# Altium schematic sheet EsquematicoAmplificador.SchDoc
size A4
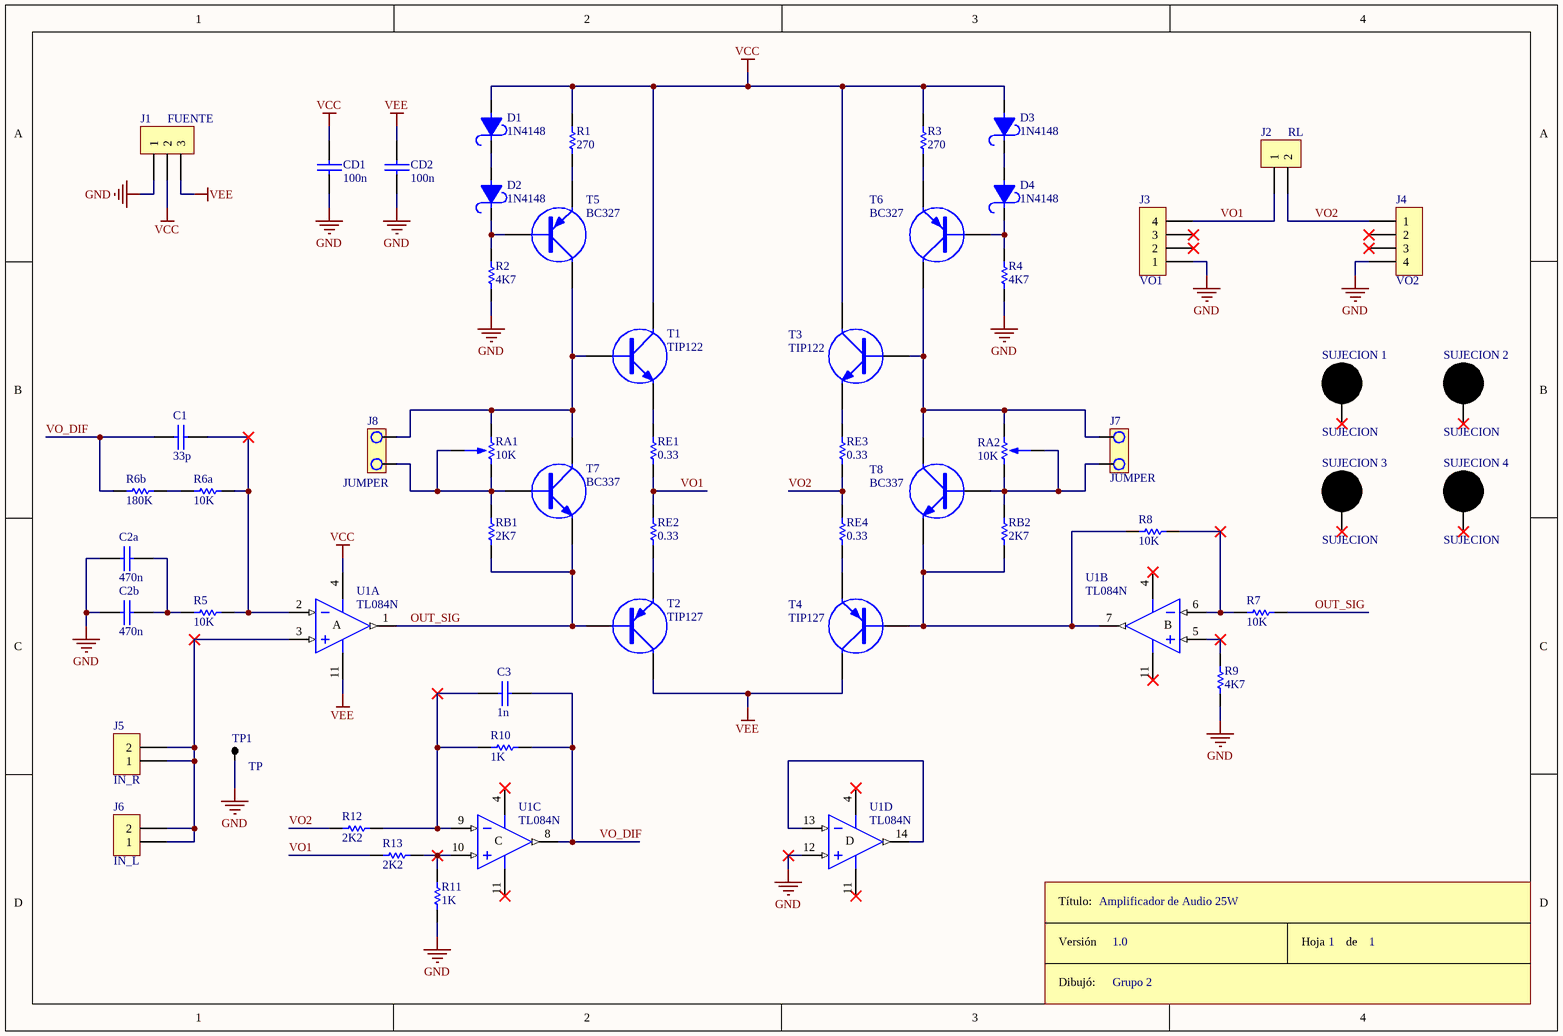
[diagram p0: EsquematicoAmplificador.SchDoc]

## Parts
C1  33p  [CAP100]
C2a  470n  [CAP200]
C2b  470n  [CAP200]
C3  1n  [CAP100]
CD1  100n  [CAP100]
CD2  100n  [CAP100]
D1  1N4148  [DO41]
D2  1N4148  [DO41]
D3  1N4148  [DO41]
D4  1N4148  [DO41]
J1  FUENTE  [CONECTOR PASO 0.156" 3 PINES]
J2  RL  [CONECTOR PASO 0.156" 2 PINES]
J3  VO1  [SIP4]
J4  VO2  [SIP4]
J5  IN_R  [SIP2]
J6  IN_L  [SIP2]
J7  JUMPER  [JUMPER2]
J8  JUMPER  [JUMPER2]
R1  270  [RES300]
R2  4K7  [RES300]
R3  270  [RES300]
R4  4K7  [RES300]
R5  10K  [RES300]
R6a  10K  [RES300]
R6b  180K  [RES300]
R7  10K  [RES300]
R8  10K  [RES300]
R9  4K7  [RES300]
R10  1K  [RES300]
R11  1K  [RES300]
R12  2K2  [RES300]
R13  2K2  [RES300]
RA1  10K  [PRESET V]
RA2  10K  [PRESET V]
RB1  2K7  [RES300]
RB2  2K7  [RES300]
RE1  0.33  [RES1200]
RE2  0.33  [RES1200]
RE3  0.33  [RES1200]
RE4  0.33  [RES1200]
ROT  Rótulo  (value not drawn)
SUJECION_1  SUJECION  [SUJECION (5.00MM - 3.50MM)]
SUJECION_2  SUJECION  [SUJECION (5.00MM - 3.50MM)]
SUJECION_3  SUJECION  [SUJECION (5.00MM - 3.50MM)]
SUJECION_4  SUJECION  [SUJECION (5.00MM - 3.50MM)]
T1  TIP122  [TO-220 V]
T2  TIP127  [TO-220 V]
T3  TIP122  [TO-220 V]
T4  TIP127  [TO-220 V]
T5  BC327  [TO92]
T6  BC327  [TO92]
T7  BC337  [TO92]
T8  BC337  [TO92]
TP1  TP  [TPTH]
U1  TL084N  [N014]  (parts A,B,C,D of 4)

## Nets
GND: C2a.1 C2b.1 CD1.2 CD2.2 J1.1 J3.1 J4.4 R2.1 R4.1 R9.1 R11.1 TP1.1 U1.12(IN+)
VCC: CD1.1 D1.1 D3.1 J1.2 R1.2 R3.2 T1.2(C) T3.2(C) U1.4(V+)
VEE: CD2.1 J1.3 T2.2(C) T4.2(C) U1.11(V-)
OUT_SIG: R7.2 RB1.1 T2.1(B) T7.3(E) U1.1(OUT)
VO1: J2.1 J3.4 R13.1 RE1.1 RE2.2
VO2: J2.2 J4.1 R12.1 RE3.1 RE4.2
VO_DIF: C1.1 C3.2 R6b.1 R10.2 U1.8(OUT)
NetC1_2: C1.2 R5.2 R6a.2 U1.2(IN-)
NetC2a_2: C2a.2 C2b.2 R5.1
NetC3_1: C3.1 R10.1 R12.2 U1.9(IN-)
NetD1_2: D1.2 D2.1
NetD2_2: D2.2 R2.2 T5.1(B)
NetD3_2: D3.2 D4.1
NetD4_2: D4.2 R4.2 T6.1(B)
NetJ5_1: J5.1 J5.2 J6.1 J6.2 U1.3(IN+)
NetJ7_1: J7.1 RA2.2 RA2.3 RB2.2 T8.1(B)
NetJ7_2: J7.2 RA2.1 T3.1(B) T6.2(C) T8.2(C)
NetJ8_1: J8.1 RA1.3 T1.1(B) T5.2(C) T7.2(C)
NetJ8_2: J8.2 RA1.1 RA1.2 RB1.2 T7.1(B)
NetR1_1: R1.1 T5.3(E)
NetR3_1: R3.1 T6.3(E)
NetR6a_1: R6a.1 R6b.2
NetR7_1: R7.1 R8.2 U1.6(IN-)
NetR8_1: R8.1 RB2.1 T4.1(B) T8.3(E) U1.7(OUT)
NetR9_2: R9.2 U1.5(IN+)
NetR11_2: R11.2 R13.2 U1.10(IN+)
NetRE1_2: RE1.2 T1.3(E)
NetRE2_1: RE2.1 T2.3(E)
NetRE3_2: RE3.2 T3.3(E)
NetRE4_1: RE4.1 T4.3(E)
NetU1_13: U1.13(IN-) U1.14(OUT)

Not connected (* = marked no-connect by the designer): J3 2* 3*; J4 2* 3*; SUJECION_1 1*; SUJECION_2 1*; SUJECION_3 1*; SUJECION_4 1*

## Notes on the sheet
- Amplificador de Audio 25W
- 1.0
- Grupo 2
- 1
- (in symbol Rótulo) Título:; Versión; Hoja       de; Dibujó:
- (in symbol TL084N, part A) A
- (in symbol TL084N, part B) B
- (in symbol TL084N, part C) C
- (in symbol TL084N, part D) D

## Library data of the parts
C1 C2a C2b C3 CD1 CD2 = CAP
D1-D4 = DIODO SCHOTTKY
J1 = CON3
J2 J5 J6 = CON2
J3 J4 = CON4
R1-R5 R6a R6b R7-R13 RB1 RB2 RE1-RE4 = RES
RA1 RA2 = PRESET
T1 T3 T7 T8 = TRANSISTOR NPN
T2 T4-T6 = TRANSISTOR PNP
U1 = TL084N: JFET-Input Operational Amplifier; Published: 16-Jan-2001; LatestRevisionDate: 04-Mar-2005; LatestRevisionNote: Stylized 3D Model Added.; DatasheetVersion: Feb-1999; PackageVersion: Oct-1995; PackageReference: N014; Publisher: Altium Limited; PackageDescription: DIP; 14 Leads; Row Spacing 7.62 mm; Pitch 2.54 mm; ComponentLink1Description: Manufacturer Link; ComponentLink1URL: http://www.ti.com/; ComponentLink2Description: Datasheet; ComponentLink2URL: http://www-s.ti.com/sc/ds/tl084.pdf